# Altium schematic sheet 05-RTC.SchDoc
size A4; DocumentNumber: 26; SheetNumber: 26; SheetTotal: 34
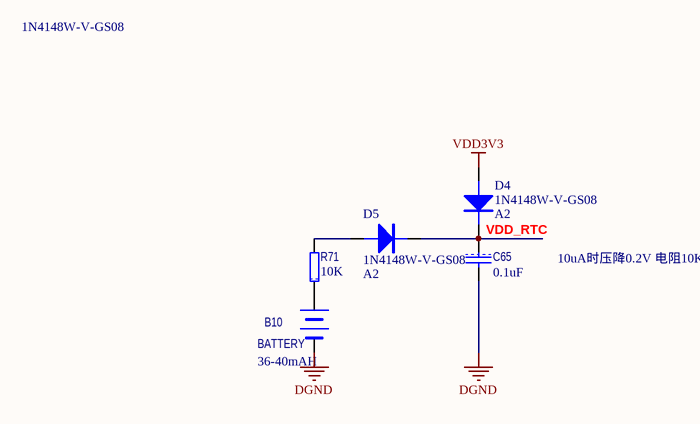
[diagram p0: 05-RTC.SchDoc]

## Parts
B10  BATTERY  volume: 36-40mAH  [BR2032-1GV]
C65  value 0.1uF  [1608[0603]C]  (hidden comment: C1608X7R1H104K)
D4  1N4148W-V-GS08  value A2  [SOD123]
D5  1N4148W-V-GS08  value A2  [SOD123]
R71  value 10K  [1608[0603]R]  (hidden comment: CRCW060310K0FKEA)

## Nets
DGND: B10.2 C65.2
VDD3V3: D4.1(A)
VDD_RTC: C65.1 D4.2(K) D5.2(K)
NetB10_1: B10.1 R71.1
NetD5_1: D5.1(A) R71.2

## Notes on the sheet
- 1N4148W-V-GS08
- 10uA时压降0.2V 电阻10K

## Library data of the parts
B10 = BATTERY: 插针 电池座
C65 = CAP: 多层陶瓷电容器MLCC - SMD/SMT 0603 0.1uF 50volts X7R 10%; Manufacturer: TDK; 产品: General Type MLCCs; 产品种类: Low & Medium Capacitance SMD Ceramic Chip Capacitors; 外壳代码 - in: 0603; 外壳代码 - mm: 1608; 封装 / 箱体: 0603 (1608 metric); 封装: Reel; 尺寸: 0.8 mm W x 1.6 mm L x 0.8 mm H; 工作温度范围: - 55 C to + 125 C; 标准包装数量: 4000; 电压额定值: 50 V; 电容-nF: 100 nF; 电容-pF: 100000 pF; 系列: C; Category: 多层陶瓷电容器MLCC - SMD/SMT; ComponentLink1Description: http://www.tdk.com/pdf/general_B11.pdf; ComponentLink1URL: http://www.tdk.com/pdf/general_B11.pdf; Description 1: 多层陶瓷电容器MLCC - SMD/SMT 0603 0.1uF 50volts X7R 10%; Manufacturer Part Number: C1608X7R1H104K; Minimum Order Quantity: 1; Pricing 1: 1=0.160, 50=0.070, 100=0.036, 500=0.019, 1000=0.013, 4000=0.010, 8000=0.009, 12000=0.008, 20000=0.007 (USD); Reeling: True; RoHS - 贸泽: Y; RoHS: RoHS Compliant; Stock 1: 224604; Supplier 1: Mouser; Supplier Part Number 1: 810-C1608X7R1H104K; 制造商: TDK; 容差: 10 %; 温度系数/代码: X7R; 电容: 0.1 uF; 端接类型: SMD/SMT
D4 D5 = 1N4148W: 二极管 - 通用，功率，开关 100V Io/150mA; Manufacturer: Vishay Semiconductors; 配置: Single; 工作温度范围: - 65 C to + 150 C; 封装 / 箱体: SOD-123; 封装: Reel; 产品: Switching Diodes; 正向连续电流: 0.15 A; 最大浪涌电流: 0.5 A; 安装风格: SMD/SMT; 恢复时间: 4 ns; 正向电压下降: 1.2 V; 制造商: Vishay; 最大二极管电容: 4 pF; 最大工作温度: + 150 C; 最大功率耗散: 350 mW; 最大反向漏泄电流: 5 uA; 最小工作温度: - 65 C; 标准包装数量: 15000; Supplier 1: Mouser; Supplier Part Number 1: 625-1N4148W-V; Manufacturer Part Number: 1N4148W-V-GS08; RoHS: RoHS Compliant; Category: 二极管 - 通用，功率，开关; Stock 1: 404148; Pricing 1: 1=0.090, 10=0.083, 50=0.072, 100=0.068, 500=0.032, 1000=0.026, 3000=0.021, 9000=0.016, 10000=0.016, 18000=0.014 (USD); 峰值反向电压: 100 V; 产品种类: Switching Diodes; RoHS - 贸泽: Y; Minimum Order Quantity: 1; Reeling: True; ComponentLink1URL: http://www.mouser.com/ds/2/427/1n4148w--240387.pdf; ComponentLink1Description: http://www.mouser.com/ds/2/427/1n4148w--240387.pdf; Description 1: 二极管 - 通用，功率，开关 100V Io/150mA
R71 = RES: 厚膜电阻器 - SMD 1/10watt 10Kohms 1%; Manufacturer: Vishay / Dale; 尺寸: 0.85 mm W x 1.55 mm L x 0.45 mm H; 工作温度范围: - 55 C to + 155 C; 封装 / 箱体: 0603 (1608 metric); 封装: Reel; 功率额定值: 100 mW; 产品: Thick Film Resistors SMD; 系列: CRCW; 温度系数: 100 PPM / K; 端接类型: SMD/SMT; 电压额定值: 75 V; 制造商: Vishay; 产品种类: 0603 Thick Film Chip Resistors; 标准包装数量: 5000; 外壳代码 - in: 0603; 外壳代码 - mm: 1608; Supplier 1: Mouser; Supplier Part Number 1: 71-CRCW0603-10K-E3; Manufacturer Part Number: CRCW060310K0FKEA; RoHS: RoHS Compliant By Exemption; Category: 厚膜电阻器 - SMD; Stock 1: 0; Pricing 1: 1=0.080, 10=0.013, 100=0.010, 1000=0.008, 5000=0.005, 25000=0.004, 50000=0.003 (USD); 电阻: 10 kOhms; 容差: 1 %; RoHS - 贸泽: E; Minimum Order Quantity: 1; Reeling: True; ComponentLink1URL: http://www.mouser.com/ds/2/427/dcrcwe3-109170.pdf; ComponentLink1Description: http://www.mouser.com/ds/2/427/dcrcwe3-109170.pdf; Description 1: 厚膜电阻器 - SMD 1/10watt 10Kohms 1%